# Altium schematic sheet Low_Current_Gate_Driver.SchDoc
size A
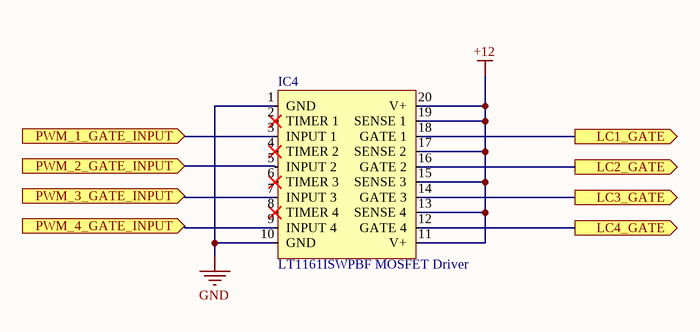
[diagram p0: Low_Current_Gate_Driver.SchDoc]

## Parts
IC4  LT1161ISWPBF MOSFET Driver  [SO-20]

## Ports
LC1_GATE (out), LC2_GATE (out), LC3_GATE (out), LC4_GATE (out), PWM_1_GATE_INPUT (in), PWM_2_GATE_INPUT (in), PWM_3_GATE_INPUT (in), PWM_4_GATE_INPUT (in)

## Nets
+12: IC4.11(V+) IC4.13(SENSE_4) IC4.15(SENSE_3) IC4.17(SENSE_2) IC4.19(SENSE_1) IC4.20(V+)
GND: IC4.1(GND) IC4.10(GND)
LC1_GATE: IC4.18(GATE_1) ; port LC1_GATE
LC2_GATE: IC4.16(GATE_2) ; port LC2_GATE
LC3_GATE: IC4.14(GATE_3) ; port LC3_GATE
LC4_GATE: IC4.12(GATE_4) ; port LC4_GATE
PWM_1_GATE_INPUT: IC4.3(INPUT_1) ; port PWM_1_GATE_INPUT
PWM_2_GATE_INPUT: IC4.5(INPUT_2) ; port PWM_2_GATE_INPUT
PWM_3_GATE_INPUT: IC4.7(INPUT_3) ; port PWM_3_GATE_INPUT
PWM_4_GATE_INPUT: IC4.9(INPUT_4) ; port PWM_4_GATE_INPUT

Not connected (* = marked no-connect by the designer): IC4 2(TIMER_1)* 4(TIMER_2)* 6(TIMER_3)* 8(TIMER_4)*

## Library data of the parts
IC4 = 16: Manufacturer_id: 1; idIC_Misc: 16; Created_By: Eunice Bernardo; Drawer_id: 1; Name: LT1161ISWPBF MOSFET Driver; Created_Date: 10/27/2018